# Altium schematic sheet Signal_Integrity_2L.SchDoc
size 420 x 297 mm; Tamanho: A4; ENG_APP_DATE: --/--/--; DSN_APP_DATE: --/--/--; CHK_APP_DATE: --/--/--; SheetNumber: 1; SheetTotal: 1
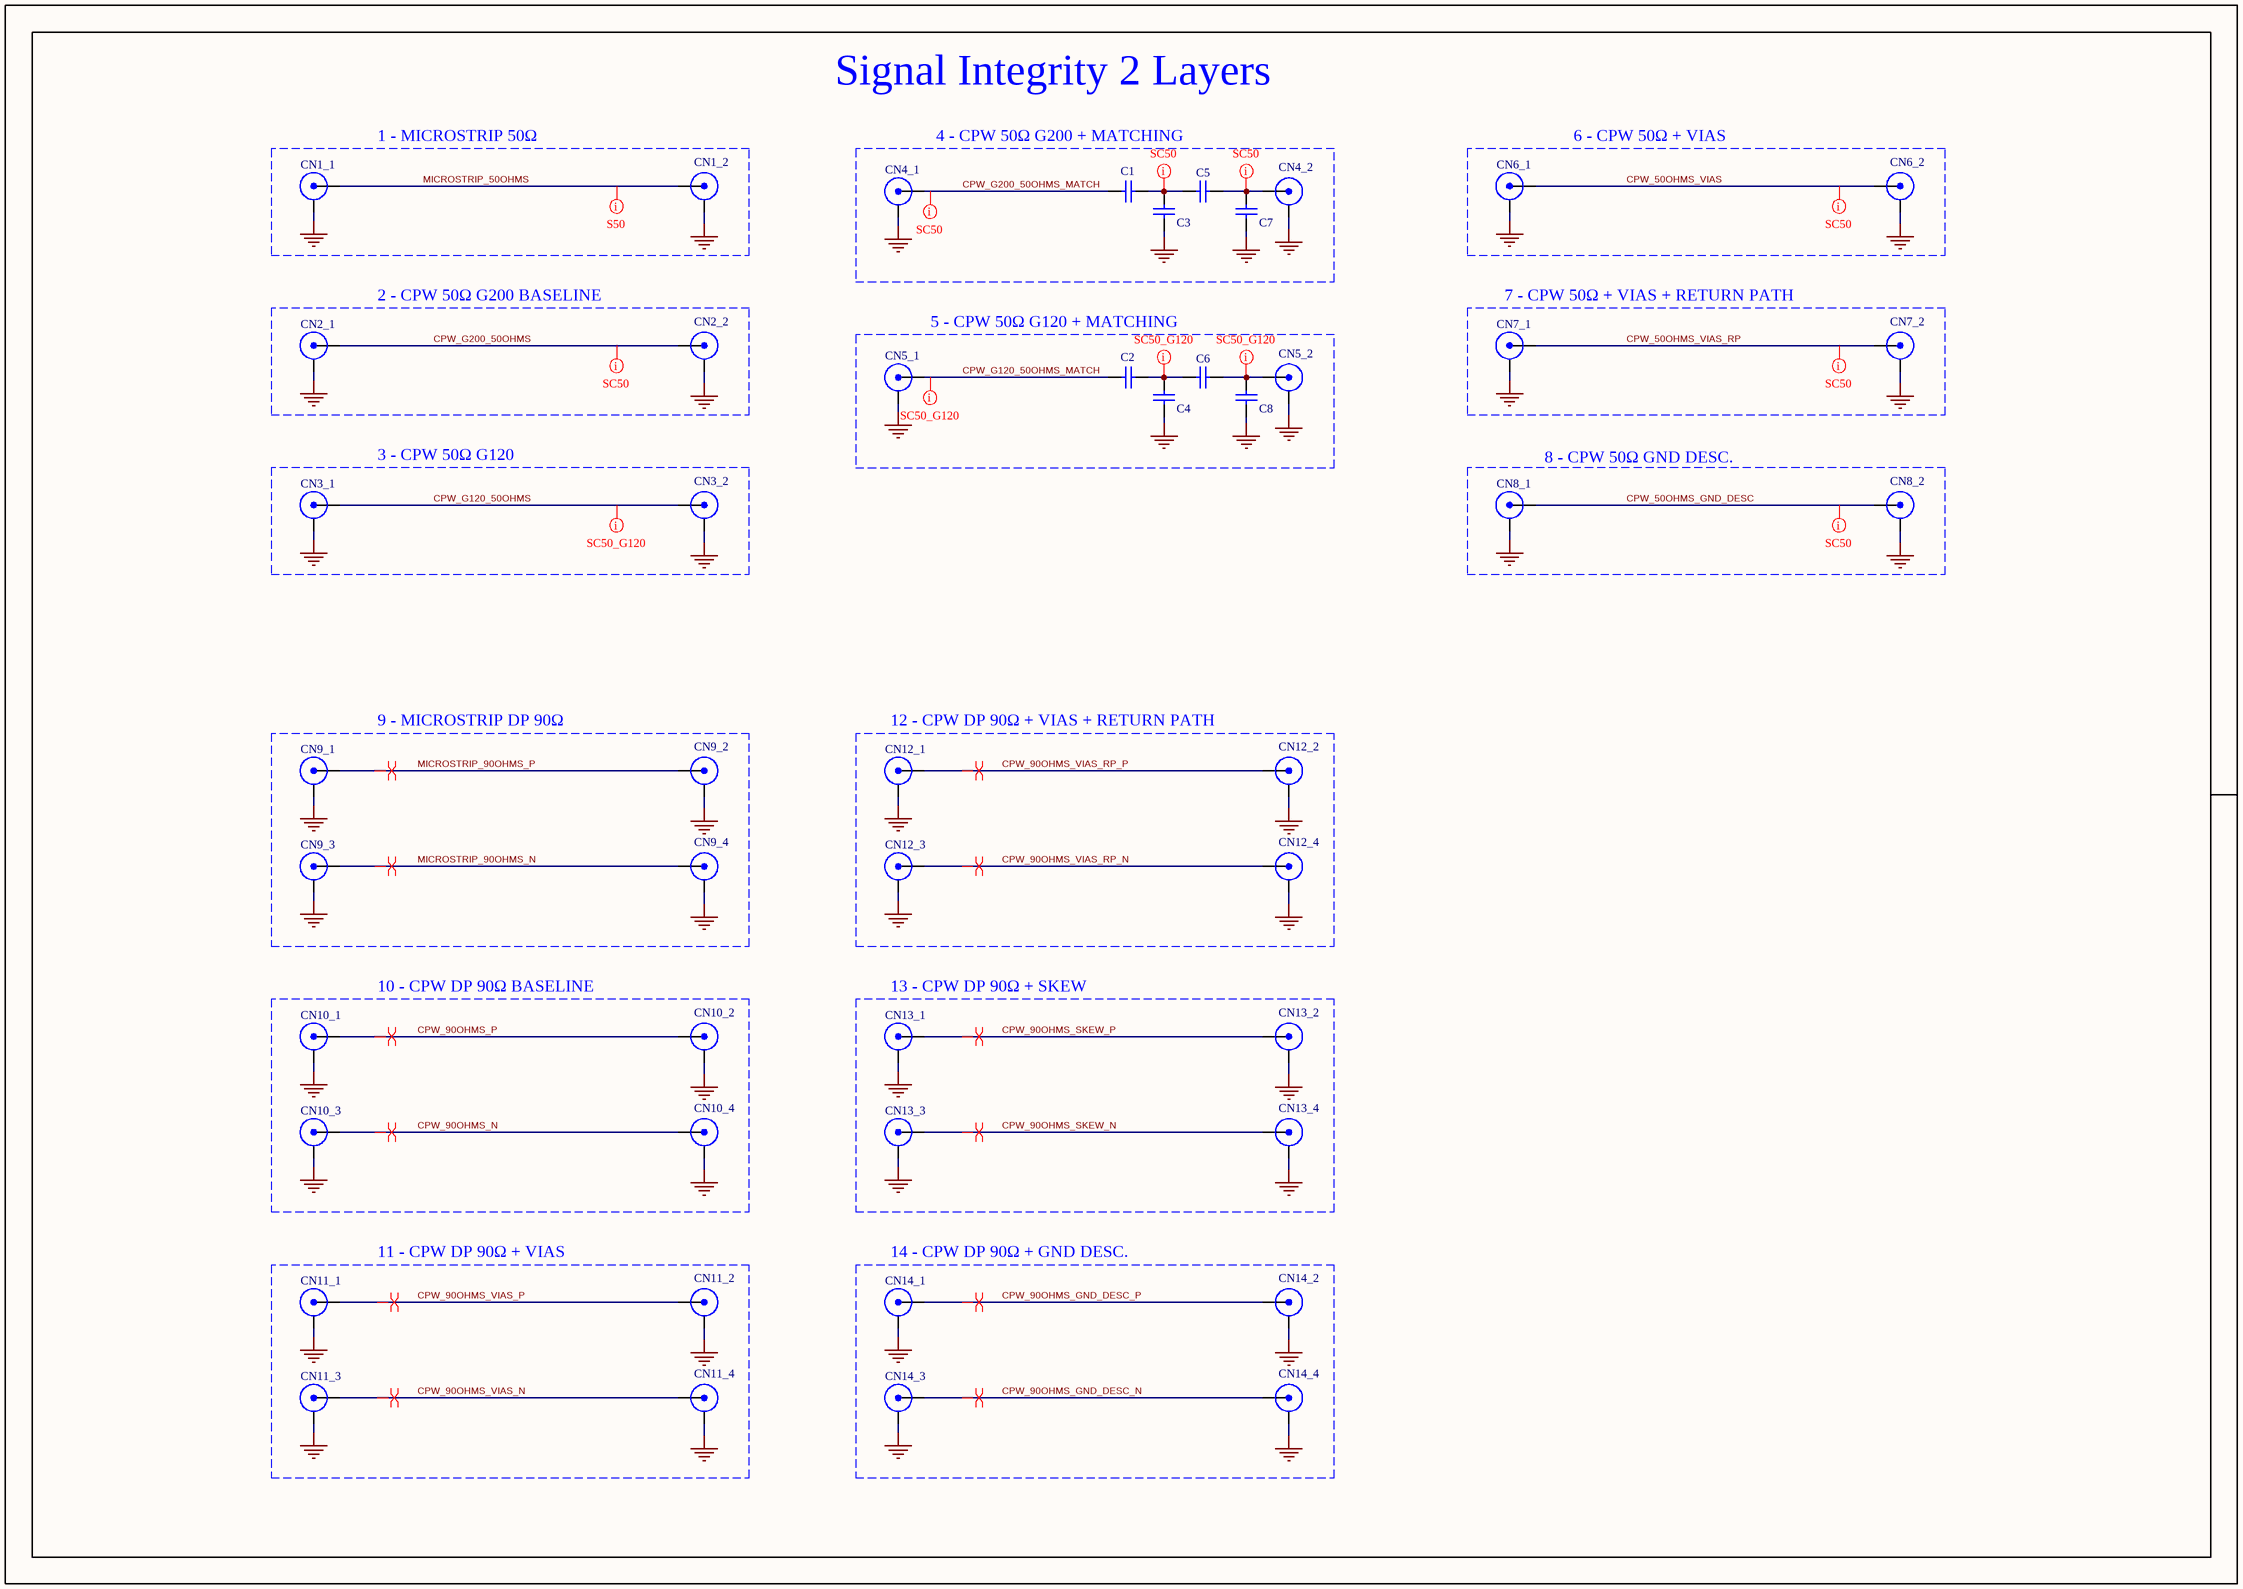
[diagram p0: Signal_Integrity_2L.SchDoc]

## Parts
C1  CAP SMD 0402  [0402]  (value not drawn)
C2  CAP SMD 0402  [0402]  (value not drawn)
C3  CAP SMD 0402  [0402]  (value not drawn)
C4  CAP SMD 0402  [0402]  (value not drawn)
C5  CAP SMD 0402  [0402]  (value not drawn)
C6  CAP SMD 0402  [0402]  (value not drawn)
C7  CAP SMD 0402  [0402]  (value not drawn)
C8  CAP SMD 0402  [0402]  (value not drawn)
CN1_1  SMA-KE EDGE  [SMA-KE EDGE]  (value not drawn)
CN1_2  SMA-KE EDGE  [SMA-KE EDGE]  (value not drawn)
CN2_1  SMA-KE EDGE  [SMA-KE EDGE]  (value not drawn)
CN2_2  SMA-KE EDGE  [SMA-KE EDGE]  (value not drawn)
CN3_1  SMA-KE EDGE  [SMA-KE EDGE]  (value not drawn)
CN3_2  SMA-KE EDGE  [SMA-KE EDGE]  (value not drawn)
CN4_1  SMA-KE EDGE  [SMA-KE EDGE]  (value not drawn)
CN4_2  SMA-KE EDGE  [SMA-KE EDGE]  (value not drawn)
CN5_1  SMA-KE EDGE  [SMA-KE EDGE]  (value not drawn)
CN5_2  SMA-KE EDGE  [SMA-KE EDGE]  (value not drawn)
CN6_1  SMA-KE EDGE  [SMA-KE EDGE]  (value not drawn)
CN6_2  SMA-KE EDGE  [SMA-KE EDGE]  (value not drawn)
CN7_1  SMA-KE EDGE  [SMA-KE EDGE]  (value not drawn)
CN7_2  SMA-KE EDGE  [SMA-KE EDGE]  (value not drawn)
CN8_1  SMA-KE EDGE  [SMA-KE EDGE]  (value not drawn)
CN8_2  SMA-KE EDGE  [SMA-KE EDGE]  (value not drawn)
CN9_1  SMA-KE EDGE  [SMA-KE EDGE]  (value not drawn)
CN9_2  SMA-KE EDGE  [SMA-KE EDGE]  (value not drawn)
CN9_3  SMA-KE EDGE  [SMA-KE EDGE]  (value not drawn)
CN9_4  SMA-KE EDGE  [SMA-KE EDGE]  (value not drawn)
CN10_1  SMA-KE EDGE  [SMA-KE EDGE]  (value not drawn)
CN10_2  SMA-KE EDGE  [SMA-KE EDGE]  (value not drawn)
CN10_3  SMA-KE EDGE  [SMA-KE EDGE]  (value not drawn)
CN10_4  SMA-KE EDGE  [SMA-KE EDGE]  (value not drawn)
CN11_1  SMA-KE EDGE  [SMA-KE EDGE]  (value not drawn)
CN11_2  SMA-KE EDGE  [SMA-KE EDGE]  (value not drawn)
CN11_3  SMA-KE EDGE  [SMA-KE EDGE]  (value not drawn)
CN11_4  SMA-KE EDGE  [SMA-KE EDGE]  (value not drawn)
CN12_1  SMA-KE EDGE  [SMA-KE EDGE]  (value not drawn)
CN12_2  SMA-KE EDGE  [SMA-KE EDGE]  (value not drawn)
CN12_3  SMA-KE EDGE  [SMA-KE EDGE]  (value not drawn)
CN12_4  SMA-KE EDGE  [SMA-KE EDGE]  (value not drawn)
CN13_1  SMA-KE EDGE  [SMA-KE EDGE]  (value not drawn)
CN13_2  SMA-KE EDGE  [SMA-KE EDGE]  (value not drawn)
CN13_3  SMA-KE EDGE  [SMA-KE EDGE]  (value not drawn)
CN13_4  SMA-KE EDGE  [SMA-KE EDGE]  (value not drawn)
CN14_1  SMA-KE EDGE  [SMA-KE EDGE]  (value not drawn)
CN14_2  SMA-KE EDGE  [SMA-KE EDGE]  (value not drawn)
CN14_3  SMA-KE EDGE  [SMA-KE EDGE]  (value not drawn)
CN14_4  SMA-KE EDGE  [SMA-KE EDGE]  (value not drawn)

## Blocks framed on the sheet
1 - MICROSTRIP 50Ω: CN1_1 CN1_2
4 - CPW 50Ω G200 + MATCHING: C1 C3 C5 C7 CN4_1 CN4_2
6 - CPW 50Ω + VIAS: CN6_1 CN6_2
2 - CPW 50Ω G200 BASELINE: CN2_1 CN2_2
7 - CPW 50Ω + VIAS + RETURN PATH: CN7_1 CN7_2
5 - CPW 50Ω G120 + MATCHING: C2 C4 C6 C8 CN5_1 CN5_2
3 - CPW 50Ω G120: CN3_1 CN3_2
8 - CPW 50Ω GND DESC.: CN8_1 CN8_2
9 - MICROSTRIP DP 90Ω: CN9_1-CN9_4
12 - CPW DP 90Ω + VIAS + RETURN PATH: CN12_1-CN12_4
10 - CPW DP 90Ω BASELINE: CN10_1-CN10_4
13 - CPW DP 90Ω + SKEW: CN13_1-CN13_4
11 - CPW DP 90Ω + VIAS: CN11_1-CN11_4
14 - CPW DP 90Ω + GND DESC.: CN14_1-CN14_4

## Nets
GND1: CN1_1.2(GND) CN1_2.2(GND)
GND2: CN2_1.2(GND) CN2_2.2(GND)
GND3: CN3_1.2(GND) CN3_2.2(GND)
GND4: C3.1 C7.1 CN4_1.2(GND) CN4_2.2(GND)
GND5: C4.1 C8.1 CN5_1.2(GND) CN5_2.2(GND)
GND6: CN6_1.2(GND) CN6_2.2(GND)
GND7: CN7_1.2(GND) CN7_2.2(GND)
GND8: CN8_1.2(GND) CN8_2.2(GND)
GND9: CN9_1.2(GND) CN9_2.2(GND) CN9_3.2(GND) CN9_4.2(GND)
GND10: CN10_1.2(GND) CN10_2.2(GND) CN10_3.2(GND) CN10_4.2(GND)
GND11: CN11_1.2(GND) CN11_2.2(GND) CN11_3.2(GND) CN11_4.2(GND)
GND12: CN12_1.2(GND) CN12_2.2(GND) CN12_3.2(GND) CN12_4.2(GND)
GND13: CN13_1.2(GND) CN13_2.2(GND) CN13_3.2(GND) CN13_4.2(GND)
GND14: CN14_1.2(GND) CN14_2.2(GND) CN14_3.2(GND) CN14_4.2(GND)
CPW_50OHMS_GND_DESC: CN8_1.1(SIGNAL) CN8_2.1(SIGNAL)
CPW_50OHMS_VIAS: CN6_1.1(SIGNAL) CN6_2.1(SIGNAL)
CPW_50OHMS_VIAS_RP: CN7_1.1(SIGNAL) CN7_2.1(SIGNAL)
CPW_90OHMS_GND_DESC_N: CN14_3.1(SIGNAL) CN14_4.1(SIGNAL)
CPW_90OHMS_GND_DESC_P: CN14_1.1(SIGNAL) CN14_2.1(SIGNAL)
CPW_90OHMS_N: CN10_3.1(SIGNAL) CN10_4.1(SIGNAL)
CPW_90OHMS_P: CN10_1.1(SIGNAL) CN10_2.1(SIGNAL)
CPW_90OHMS_SKEW_N: CN13_3.1(SIGNAL) CN13_4.1(SIGNAL)
CPW_90OHMS_SKEW_P: CN13_1.1(SIGNAL) CN13_2.1(SIGNAL)
CPW_90OHMS_VIAS_N: CN11_3.1(SIGNAL) CN11_4.1(SIGNAL)
CPW_90OHMS_VIAS_P: CN11_1.1(SIGNAL) CN11_2.1(SIGNAL)
CPW_90OHMS_VIAS_RP_N: CN12_3.1(SIGNAL) CN12_4.1(SIGNAL)
CPW_90OHMS_VIAS_RP_P: CN12_1.1(SIGNAL) CN12_2.1(SIGNAL)
CPW_G120_50OHMS: CN3_1.1(SIGNAL) CN3_2.1(SIGNAL)
CPW_G120_50OHMS_MATCH: C2.1 CN5_1.1(SIGNAL)
CPW_G200_50OHMS: CN2_1.1(SIGNAL) CN2_2.1(SIGNAL)
CPW_G200_50OHMS_MATCH: C1.1 CN4_1.1(SIGNAL)
MICROSTRIP_50OHMS: CN1_1.1(SIGNAL) CN1_2.1(SIGNAL)
MICROSTRIP_90OHMS_N: CN9_3.1(SIGNAL) CN9_4.1(SIGNAL)
MICROSTRIP_90OHMS_P: CN9_1.1(SIGNAL) CN9_2.1(SIGNAL)
NetC1_2: C1.2 C3.2 C5.1
NetC2_2: C2.2 C4.2 C6.1
NetC5_2: C5.2 C7.2 CN4_2.1(SIGNAL)
NetC6_2: C6.2 C8.2 CN5_2.1(SIGNAL)

## Layout directives
net class S50: MICROSTRIP_50OHMS
net class SC50: CPW_50OHMS_GND_DESC, CPW_50OHMS_VIAS, CPW_50OHMS_VIAS_RP, CPW_G200_50OHMS, CPW_G200_50OHMS_MATCH, NetC1_2, NetC5_2
net class SC50_G120: CPW_G120_50OHMS, CPW_G120_50OHMS_MATCH, NetC2_2, NetC6_2
differential pair; differential pair class DP90: MICROSTRIP_90OHMS_N, MICROSTRIP_90OHMS_P
differential pair; differential pair class DPC90: CPW_90OHMS_GND_DESC_N, CPW_90OHMS_GND_DESC_P, CPW_90OHMS_N, CPW_90OHMS_P, CPW_90OHMS_SKEW_N, CPW_90OHMS_SKEW_P, CPW_90OHMS_VIAS_N, CPW_90OHMS_VIAS_P, CPW_90OHMS_VIAS_RP_N, CPW_90OHMS_VIAS_RP_P

## Notes on the sheet
- Signal Integrity 2 Layers

## Library data of the parts
C1-C8 = CAP SMD 0402: 0402
CN1_1 CN1_2 CN2_1 CN2_2 CN3_1 CN3_2 CN4_1 CN4_2 CN5_1 CN5_2 CN6_1 CN6_2 CN7_1 CN7_2 CN8_1 CN8_2 CN9_1-CN9_4 CN10_1-CN10_4 CN11_1-CN11_4 CN12_1-CN12_4 CN13_1-CN13_4 CN14_1-CN14_4 = SMA-KE EDGE: SMA Connector Receptacle, Female Socket 50Ohm Board Edge, End Launch Solder; Manufacturer_Name: TE Connectivity; Manufacturer_Part_Number: CONSMA020.062-G; Geometry.Height: 7.92mm; Mouser Part Number: 712-CONSMA020.062-G; Mouser Price/Stock: https://www.mouser.co.uk/ProductDetail/Linx-Technologies/CONSMA020.062-G?qs=xZ%2FP%252Ba9zWqa7zEs9%2FuMaNQ%3D%3D; Datasheet Link: https://componentsearchengine.com/Datasheets/1/CONSMA020.062-G.pdf